# Altium schematic sheet Sim7600.SchDoc
size B
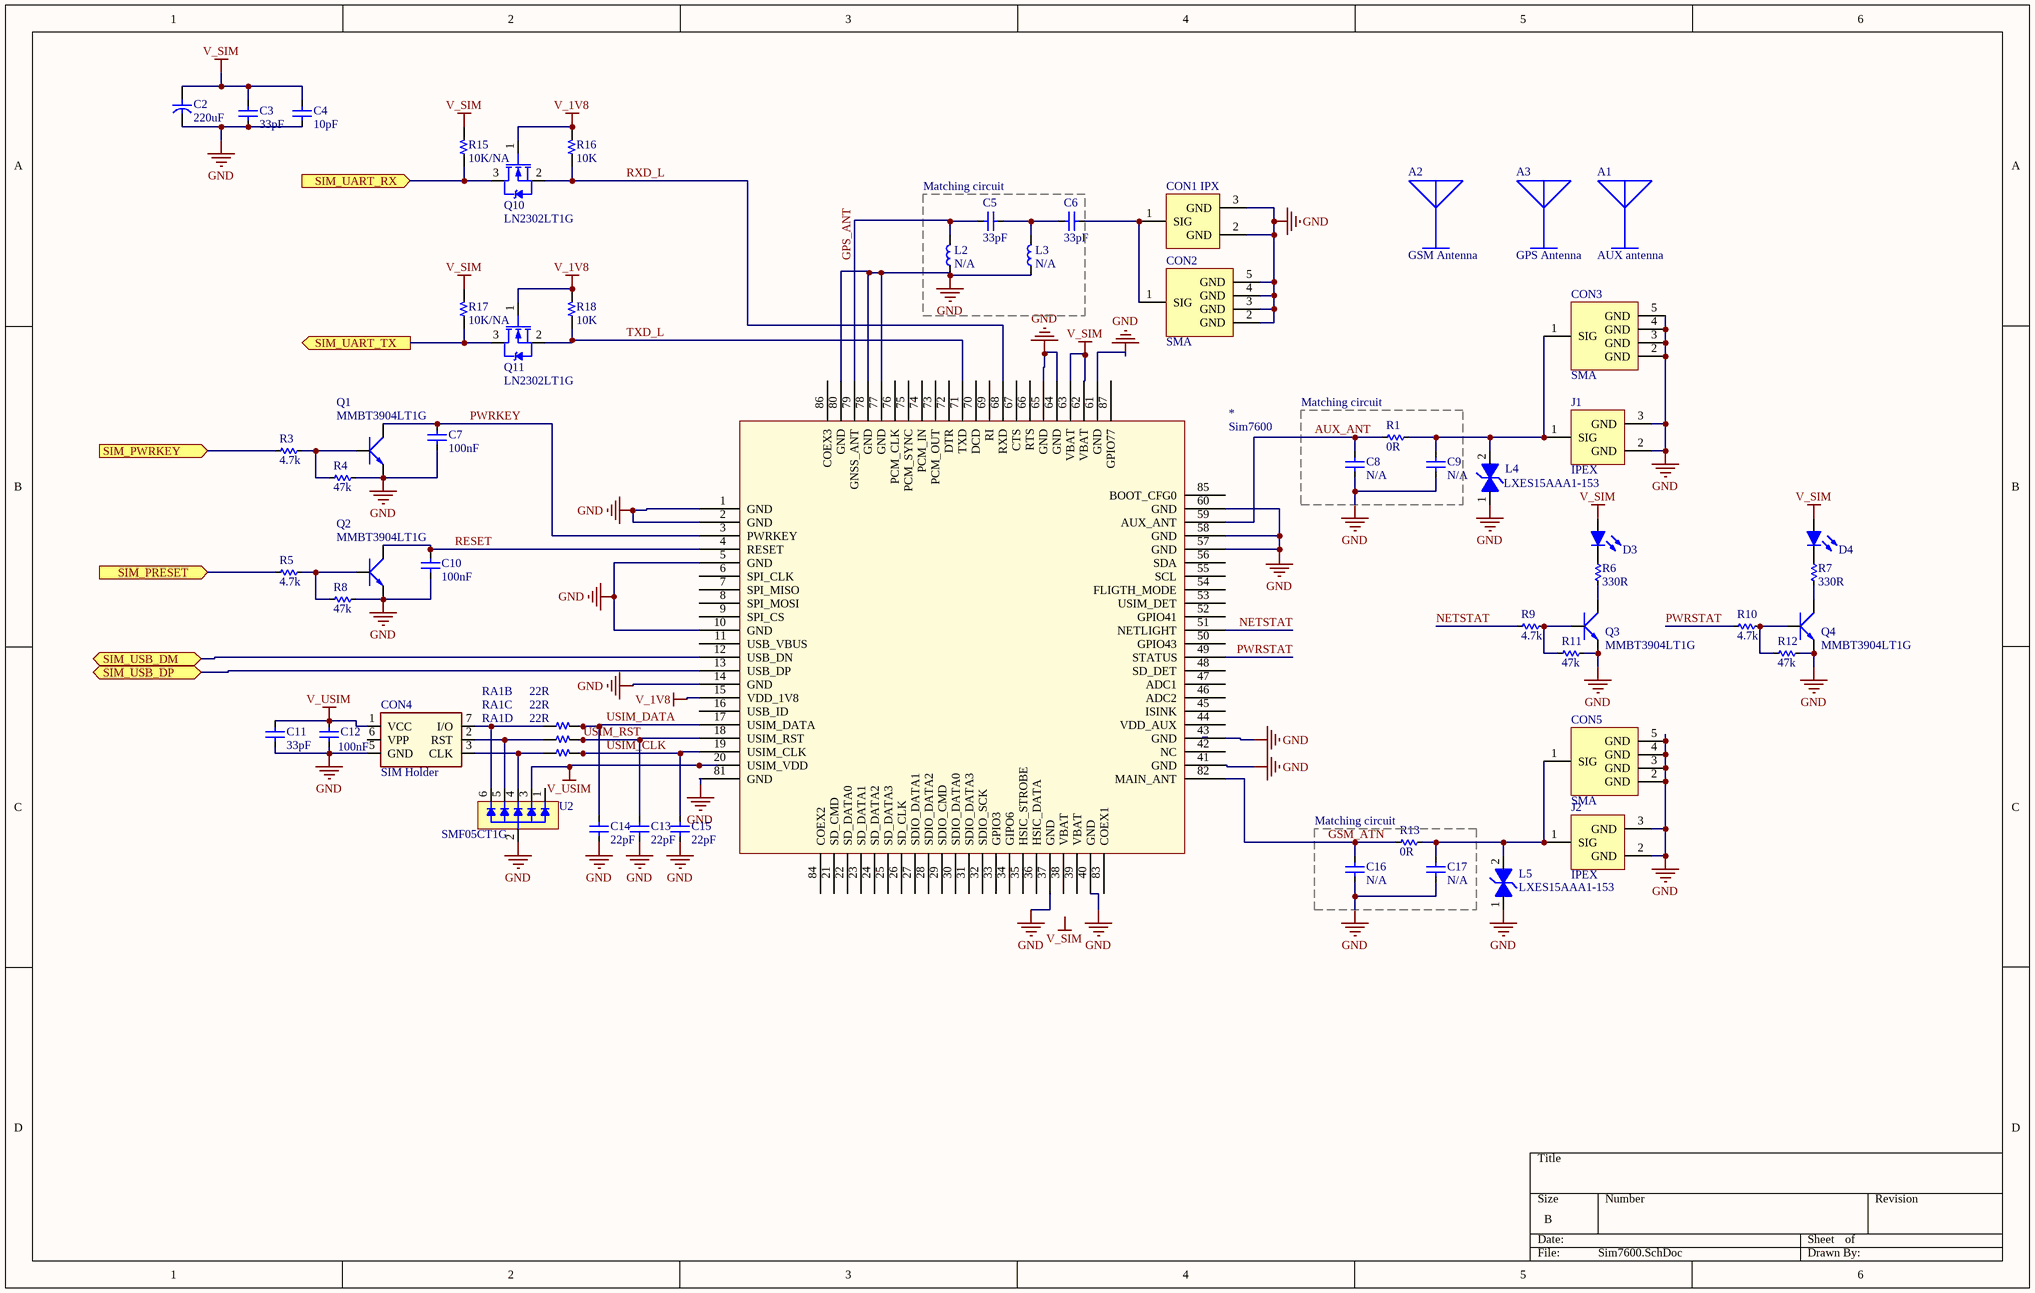
[diagram p0: Sim7600.SchDoc]

## Parts
*  Sim7600  [Sim7600]
A1  AUX antenna  [Antenna]
A2  GSM Antenna  [Antenna]
A3  GPS Antenna  [Antenna]
C2  220uF  [C SMD ALU (D8)]
C3  33pF  [CC 0603]
C4  10pF  [CC 0603]
C5  33pF  [CC 0603]
C6  33pF  [CC 0603]
C7  100nF  [CC 0603]
C8  N/A  [CC 0603]
C9  N/A  [CC 0603]
C10  100nF  [CC 0603]
C11  33pF  [CC 0603]
C12  100nF  [CC 0603]
C13  22pF  [CC 0603]
C14  22pF  [CC 0603]
C15  22pF  [CC 0603]
C16  N/A  [CC 0603]
C17  N/A  [CC 0603]
CON1  IPX  [CONN/IPX/SMD]
CON2  SMA  [CONN/SMA/RA]
CON3  SMA  [CONN/SMA/RA]
CON4  SIM Holder  [CON SIM Holder C707]
CON5  SMA  [CONN/SMA/RA]
D3  LED GREEN  [Led 0603 - green]  (value not drawn)
D4  LED RED  [Led 0603 - red]  (value not drawn)
J1  IPEX  [CONN/IPX/SMD]
J2  IPEX  [CONN/IPX/SMD]
L2  N/A  [LL 0603]
L3  N/A  [LL 0603]
L4  LXES15AAA1-153  [C 0603]
L5  LXES15AAA1-153  [C 0603]
Q1  MMBT3904LT1G  [SOT-23]
Q2  MMBT3904LT1G  [SOT-23]
Q3  MMBT3904LT1G  [SOT-23]
Q4  MMBT3904LT1G  [SOT-23]
Q10  LN2302LT1G  [SOT-23]
Q11  LN2302LT1G  [SOT-23]
R1  0R  [RR 0603]
R3  4.7k  [RR 0603]
R4  47k  [RR 0603]
R5  4.7k  [RR 0603]
R6  330R  [RR 0603]
R7  330R  [RR 0603]
R8  47k  [RR 0603]
R9  4.7k  [RR 0603]
R10  4.7k  [RR 0603]
R11  47k  [RR 0603]
R12  47k  [RR 0603]
R13  0R  [RR 0603]
R15  10K/NA  [R 0603]
R16  10K  [R 0603]
R17  10K/NA  [R 0603]
R18  10K  [R 0603]
RA1  22R  [RAx4 1206 (3216)]  (parts B,C,D of 4)
U2  SMF05CT1G  [SOT-363-6]

## Blocks framed on the sheet
Matching circuit: C5 C6 L2 L3
Matching circuit: C8 C9 R1
Matching circuit: C16 C17 R13

## Ports
SIM_PRESET (in), SIM_PWRKEY (in), SIM_UART_RX (in), SIM_UART_TX (out), SIM_USB_DM, SIM_USB_DP

## Nets
GND: *.1(GND) *.2(GND) *.5(GND) *.10(GND) *.14(GND) *.37(GND) *.40(GND) *.41(GND) *.43(GND) *.57(GND) *.58(GND) *.60(GND) *.61(GND) *.64(GND) *.65(GND) *.77(GND) *.78(GND) *.80(GND) *.81(GND) C2.2 C3.1 C4.1 C7.2 C8.1 C9.1 C10.2 C11.2 C12.2 C13.2 C14.2 C15.2 C16.1 C17.1 CON1.2(GND) CON1.3(GND) CON2.2(GND) CON2.3(GND) CON2.4(GND) CON2.5(GND) CON3.2(GND) CON3.3(GND) CON3.4(GND) CON3.5(GND) CON4.5(GND) CON5.2(GND) CON5.3(GND) CON5.4(GND) CON5.5(GND) J1.2(GND) J1.3(GND) J2.2(GND) J2.3(GND) L2.1 L3.1 L4.1 L5.1 Q1.2(E) Q2.2(E) Q3.2(E) Q4.2(E) R4.2 R8.2 R11.2 R12.2 U2.2(A)
V_1V8: *.15(VDD_1V8) Q10.1(G) Q11.1(G) R16.2 R18.2
V_SIM: *.62(VBAT) *.63(VBAT) C2.1 C3.2 C4.2 D3.1(A) D4.1(A) R15.2 R17.2
V_USIM: *.20(USIM_VDD) C11.1 C12.1 CON4.1(VCC) U2.3(K3)
AUX_ANT: *.59(AUX_ANT) C8.2 R1.2
GPS_ANT: *.79(GNSS_ANT) C5.2 L2.2
GSM_ATN: *.82(MAIN_ANT) C16.2 R13.2
NETSTAT: *.51(NETLIGHT) R9.1
PWRKEY: *.3(PWRKEY) C7.1 Q1.3(C)
PWRSTAT: *.49(STATUS) R10.1
RESET: *.4(RESET) C10.1 Q2.3(C)
RXD_L: *.68(RXD) Q10.2(S) R16.1
SIM_PRESET: R5.1 ; port SIM_PRESET
SIM_PWRKEY: R3.1 ; port SIM_PWRKEY
SIM_UART_RX: Q10.3(D) R15.1 ; port SIM_UART_RX
SIM_UART_TX: Q11.3(D) R17.1 ; port SIM_UART_TX
SIM_USB_DM: *.12(USB_DN) ; port SIM_USB_DM
SIM_USB_DP: *.13(USB_DP) ; port SIM_USB_DP
TXD_L: *.71(TXD) Q11.2(S) R18.1
USIM_CLK: *.19(USIM_CLK) C15.1 RA1.5
USIM_DATA: *.17(USIM_DATA) C14.1 RA1.7
USIM_RST: *.18(USIM_RST) C13.1 RA1.6
NetC5_1: C5.1 C6.2 L3.2
NetC6_1: C6.1 CON1.1(SIG) CON2.1(SIG)
NetC9_2: C9.2 CON3.1(SIG) J1.1(SIG) L4.2 R1.1
NetC17_2: C17.2 CON5.1(SIG) J2.1(SIG) L5.2 R13.1
NetCON4_2: CON4.2(RST) RA1.3 U2.5(K5)
NetCON4_3: CON4.3(CLK) RA1.4 U2.4(K4)
NetCON4_7: CON4.7(I/O) RA1.2 U2.6(K6)
NetD3_2: D3.2(K) R6.2
NetD4_2: D4.2(K) R7.2
NetQ1_1: Q1.1(B) R3.2 R4.1
NetQ2_1: Q2.1(B) R5.2 R8.1
NetQ3_1: Q3.1(B) R9.2 R11.1
NetQ3_3: Q3.3(C) R6.1
NetQ4_1: Q4.1(B) R10.2 R12.1
NetQ4_3: Q4.3(C) R7.1

Not connected (* = marked no-connect by the designer): * 6(SPI_CLK) 7(SPI_MISO) 8(SPI_MOSI) 9(SPI_CS) 11(USB_VBUS) 16(USB_ID) 21(SD_CMD) 22(SD_DATA0) 23(SD_DATA1) 24(SD_DATA2) 25(SD_DATA3) 26(SD_CLK) 27(SDIO_DATA1) 28(SDIO_DATA2) 29(SDIO_CMD) 30(SDIO_DATA0) 31(SDIO_DATA3) 32(SDIO_SCK) 33(GPIO3) 34(GIPO6) 35(HSIC_STROBE) 36(HSIC_DATA) 38(VBAT) 39(VBAT) 42(NC) 44(VDD_AUX) 45(ISINK) 46(ADC2) 47(ADC1) 48(SD_DET) 50(GPIO43) 52(GPIO41) 53(USIM_DET) 54(FLIGTH_MODE) 55(SCL) 56(SDA) 66(RTS) 67(CTS) 69(RI) 70(DCD) 72(DTR) 73(PCM_OUT) 74(PCM_IN) 75(PCM_SYNC) 76(PCM_CLK) 83(COEX1) 84(COEX2) 85(BOOT_CFG0) 86(COEX3) 87(GPIO77); CON4 6(VPP); U2 1(K1)

## Notes on the sheet
- Labels drawn without touching a wire or pin: V_SIM

## Library data of the parts
A1-A3 = Antenna
C2 = Capacitor: CAP TANT POLY 100UF 6.3V 1210; Manufacturer: AVX Corporation; Manufacturer Part Number: TCJB107M006R0055; Package: 1210 (3528 Metric); Supplier 1: Digi-Key; Supplier Part Number 1: 478-9410-2-ND; Termination Style: SMD/SMT
C3 C5 C6 C11 C13-C15 = Capacitor NP: CAP CER 33PF 100V C0G/NP0 0603; Manufacturer: Murata Electronics; Manufacturer Part Number: GCM1885C2A330JA16D; Supplier 1: Digi-Key; Supplier Part Number 1: 490-4943-2-ND; Termination Style: SMD/SMT; Package: 0603 (1608 Metric)
C4 = Capacitor NP: CAP CER 10PF 100V C0G/NP0 0603; Manufacturer: Murata Electronics; Manufacturer Part Number: GCM1885C2A100JA16D; Supplier 1: Digi-Key; Supplier Part Number 1: 490-4770-2-ND; Termination Style: SMD/SMT; Package: 0603 (1608 Metric)
C7 C10 C12 = Capacitor NP: CAP CER 0.1UF 16V X7R 0603; Manufacturer: Murata Electronics; Manufacturer Part Number: GCJ188R71C104KA01D; Supplier 1: Digi-Key; Supplier Part Number 1: 490-5796-2-ND; Termination Style: SMD/SMT; Package: 0603 (1608 Metric)
C8 C9 C16 C17 = Capacitor NP: CAP N/A; Supplier 1: Digi-Key; Termination Style: SMD/SMT; Package: 0603 (1608 Metric)
CON1 = CON IPX
CON2 CON3 CON5 = CON SMA: SMA connectors
CON4 = SIM holder 6 pin: SIM Card holder, 6 pins
D3 = Led: LED GREEN DIFFUSED 0603 SMD; Manufacturer: Rohm Semiconductor; Manufacturer Part Number: SML-D12P8WT86; Package: 0603 (1608 Metric); Supplier 1: Digi-Key; Supplier Part Number 1: 511-1579-2-ND; Termination Style: SMD/SMT
D4 = Led: LED RED DIFFUSED 0603 SMD; Manufacturer: Rohm Semiconductor; Manufacturer Part Number: SML-D12U8WT86; Package: 0603 (1608 Metric); Supplier 1: Digi-Key; Supplier Part Number 1: 511-1580-2-ND; Termination Style: SMD/SMT
J1 J2 = CON IPX: CONN UMC RCPT STR 50 OHM SMD; Manufacturer: Taoglas Limited; Manufacturer Part Number: RECE.20279.001E.01; Supplier 1: Digi-Key; Supplier Part Number 1: 931-1107-1-ND; Termination Style: SMD/SMT
L2 L3 = Inductor: IND N/A; Supplier 1: Digi-Key; Termination Style: SMD/SMT; Package: 0603 (1608 Metric)
L4 L5 = LXES15AAA1-153: Clamp Ipp Tvs Diode Surface Mount 1005; MF: Murata; SnapEDA_Link: https://www.snapeda.com/parts/LXES15AAA1-153/Murata%20Electronics%20North%20America/view-part/653473/?ref=snap; MP: LXES15AAA1-153; Value: *; Digi-Key_Part_Number: 490-13210-1-ND; Digi-Key_Purchase_URL: https://www.digikey.kr/product-detail/en/murata-electronics/LXES15AAA1-153/490-13210-1-ND/5843764?utm_source=snapeda&utm_medium=aggregator&utm_campaign=symbol; Package: 0402 Murata
Q1-Q4 = MMBT3904LT1G: TRANS NPN 40V 0.2A SOT23; Manufacturer: ON Semiconductor; Supplier 1: Digi-Key; Supplier Part Number 1: MMBT3904LT1GOSCT-ND; Manufacturer Part Number: MMBT3904LT1G; Package: SOT-23-3 (TO-236); Termination Style: SMD/SMT
Q10 Q11 = Mosfet N
R1 R13 = Resistors: RES SMD 0 OHM JUMPER 1/10W 0603; Manufacturer: Panasonic Industrial Devices; Manufacturer Part Number: ERJ-3GEY0R00V; Supplier 1: Digi-Key; Supplier Part Number 1: P0.0GTR-ND; Termination Style: SMD/SMT; Package: 0603 (1608 Metric)
R3 R5 R9 R10 = Resistors: RES SMD 4.7K OHM 1% 1/10W 0603; Manufacturer: Panasonic Industrial Devices; Manufacturer Part Number: ERJ-3EKF4701V; Supplier 1: Digi-Key; Supplier Part Number 1: P4.70KHTR-ND; Termination Style: SMD/SMT; Package: 0603 (1608 Metric)
R4 R8 R11 R12 = Resistors: RES SMD 47K OHM 5% 1/10W 0603; Manufacturer: Panasonic Industrial Devices; Manufacturer Part Number: ERJ-3GEYJ473V; Supplier 1: Digi-Key; Supplier Part Number 1: P47KGTR-ND; Termination Style: SMD/SMT; Package: 0603 (1608 Metric)
R6 R7 = Resistors: RES SMD 330 OHM 5% 1/10W 0603; Manufacturer: Panasonic Industrial Devices; Manufacturer Part Number: ERJ-3GEYJ331V; Supplier 1: Digi-Key; Supplier Part Number 1: P330GTR-ND; Termination Style: SMD/SMT; Package: 0603 (1608 Metric)
R15-R18 = Resistor
RA1 = Resistor Array x4
U2 = SMF05C: TVS DIODE 5V 12.5V SC88; Manufacturer: ON Semiconductor; Manufacturer Part Number: SMF05CT1G; Package: 6-TSSOP, SC-88, SOT-363; Supplier 1: Digi-Key; Supplier Part Number 1: SMF05CT1GOSCT-ND; Termination Style: SMD/SMT